# Altium schematic sheet Microcontroller.SchDoc
size A3; SheetNumber: 5; SheetTotal: 9
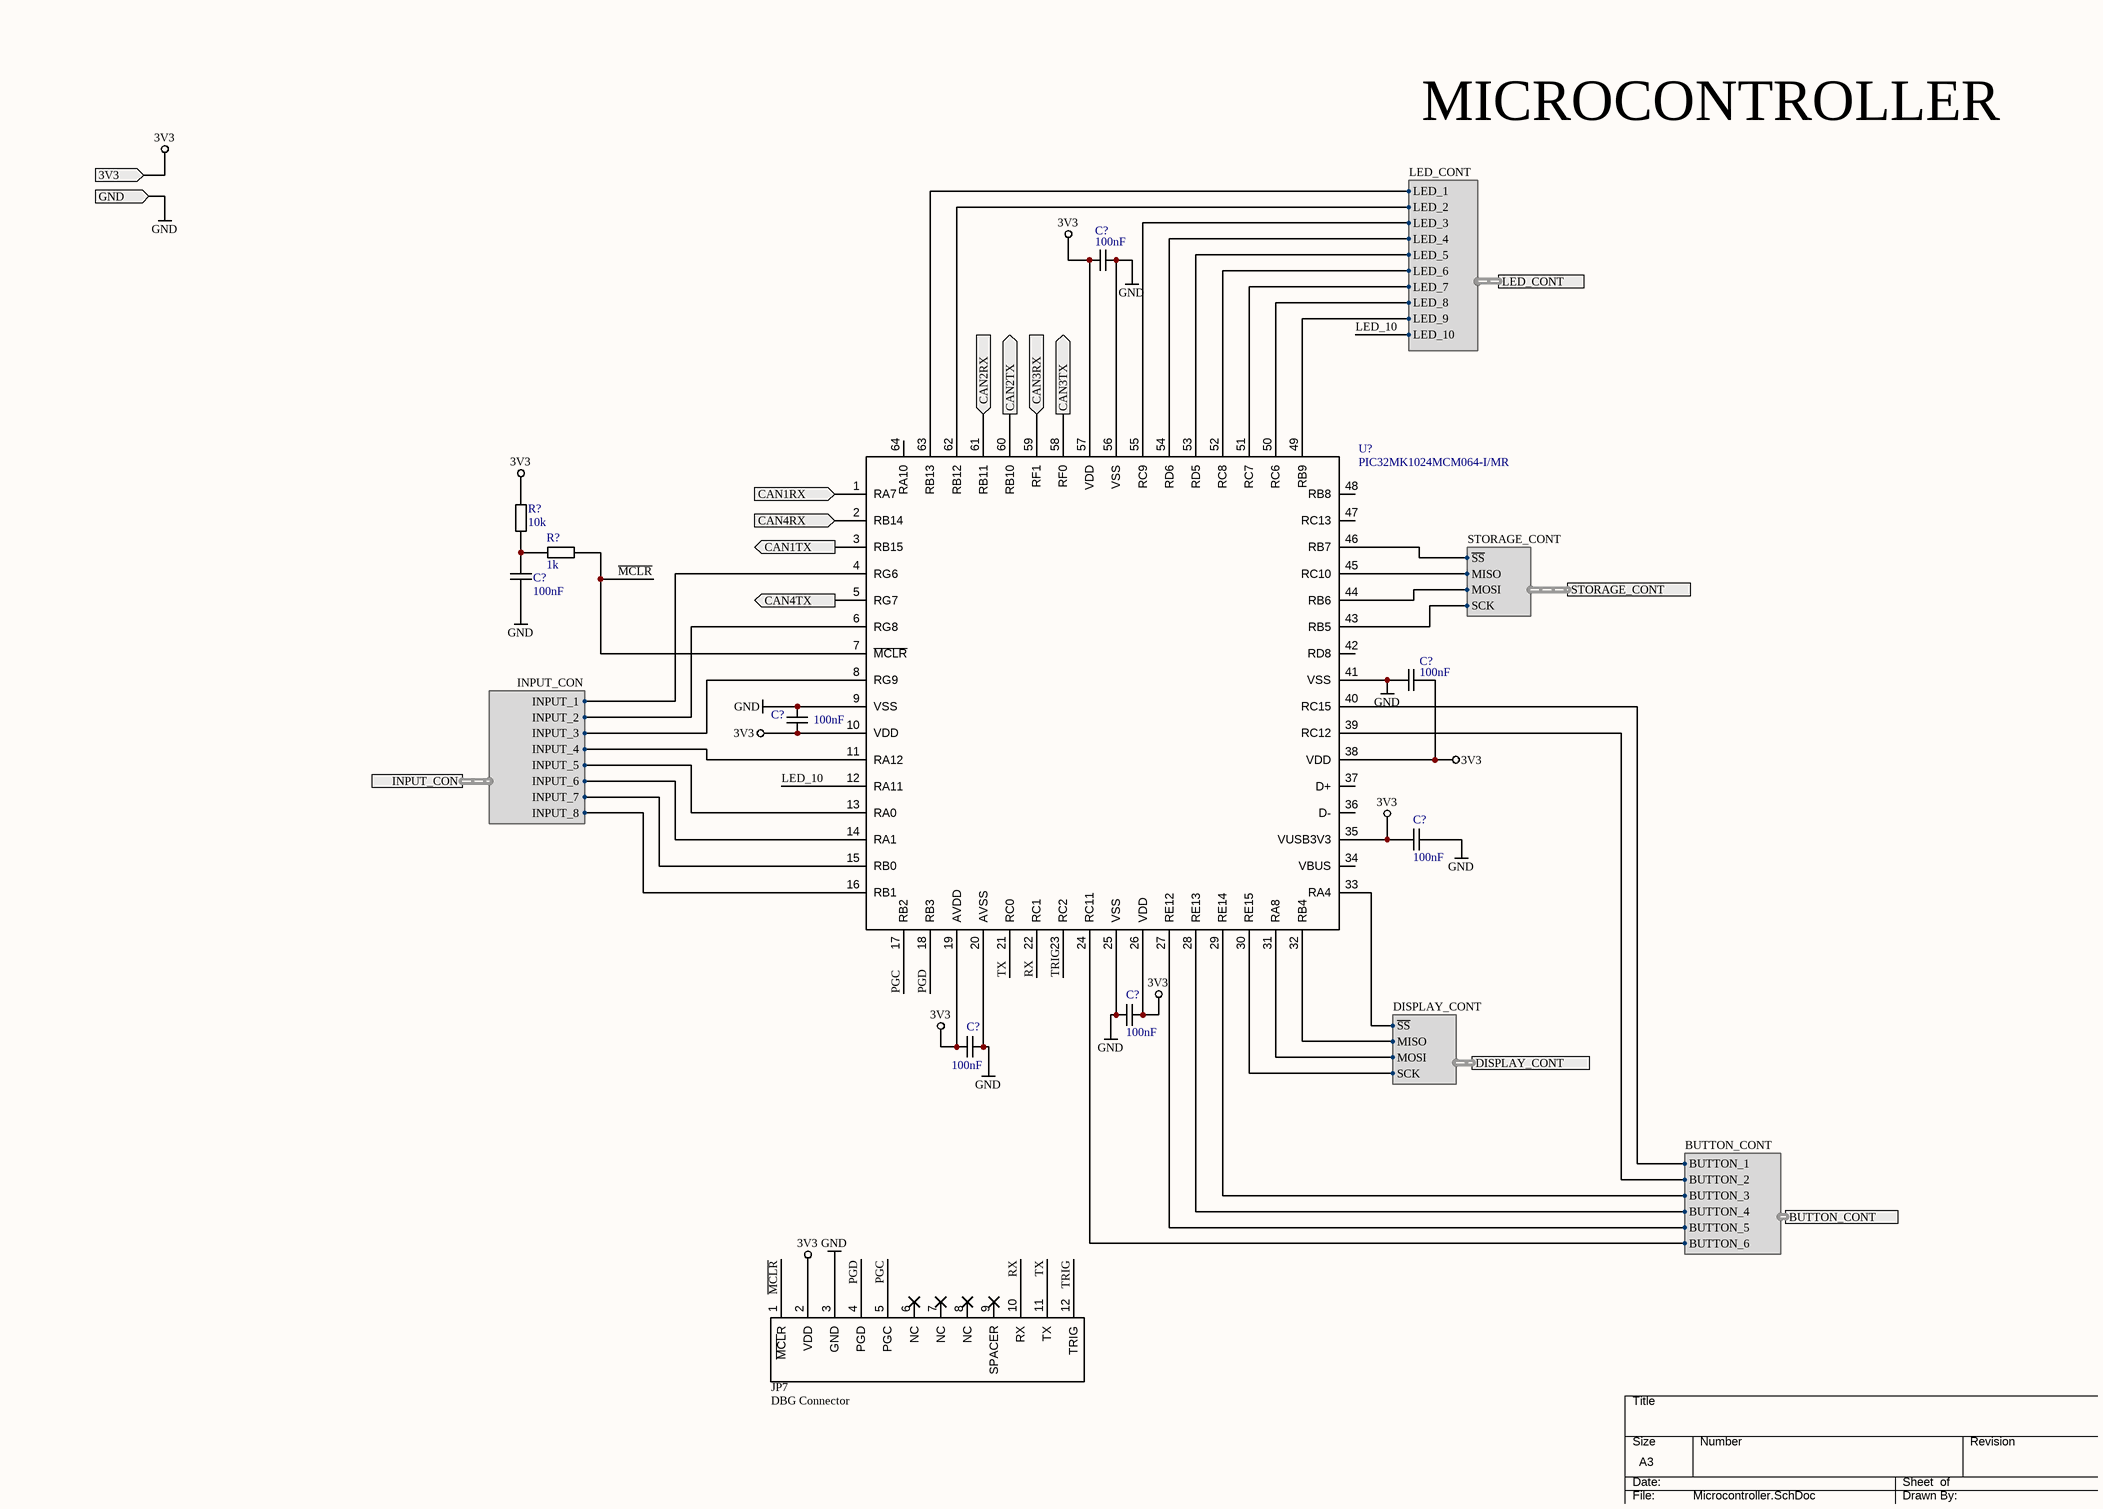
[diagram p0: Microcontroller.SchDoc]

## Parts
(Parts that share a designator on the sheet are numbered #1, #2 ... from top to bottom, then left to right.)
C?#1  100nF  [C_0402]
C?#2  100nF  [C_0402]
C?#3  100nF  [C_0402]
C?#4  100nF  [C_0402]
C?#5  100nF  [C_0402]
C?#6  100nF  [C_0402]
C?#7  100nF  [C_0402]
JP7  DBG Connector  [HDRV12W63P0X254_1X12_3048X254X950P]
R?#1  10k  [R_0402]
R?#2  1k  [R_0402]
U?  PIC32MK1024MCM064-I/MR  [PIC32MK1024MCM064-I/MR]

## Ports
3V3 (in), BUTTON_CONT (harness BUTTON_CONT), CAN1RX (in), CAN1TX (out), CAN2RX (in), CAN2TX (out), CAN3RX (in), CAN3TX (out), CAN4RX (in), CAN4TX (out), DISPLAY_CONT (harness DISPLAY_CONT), GND (in), INPUT_CON (harness INPUT_CON), LED_CONT (harness LED_CONT), STORAGE_CONT (harness STORAGE_CONT)

## Harnesses
INPUT_CON: INPUT_1, INPUT_2, INPUT_3, INPUT_4, INPUT_5, INPUT_6, INPUT_7, INPUT_8
LED_CONT: LED_1, LED_2, LED_3, LED_4, LED_5, LED_6, LED_7, LED_8, LED_9, LED_10
BUTTON_CONT: BUTTON_1, BUTTON_2, BUTTON_3, BUTTON_4, BUTTON_5, BUTTON_6
DISPLAY_CONT: MOSI, MISO, SCK, ~{SS}
STORAGE_CONT: MOSI, MISO, SCK, ~{SS}

## Nets
3V3: C?#1.1 C?#3.1 C?#4.1 C?#5.1 C?#6.1 C?#7.1 JP7.2(VDD) R?#1.2 U?.10(VDD) U?.19(AVDD) U?.26(VDD) U?.35(VUSB3V3) U?.38(VDD) U?.57(VDD) ; port 3V3
GND: C?#1.2 C?#2.1 C?#3.2 C?#4.2 C?#5.2 C?#6.2 C?#7.2 JP7.3(GND) U?.9(VSS) U?.20(AVSS) U?.25(VSS) U?.41(VSS) U?.56(VSS) ; port GND
CAN1RX: U?.1(RA7) ; port CAN1RX
CAN1TX: U?.3(RB15) ; port CAN1TX
CAN2RX: U?.61(RB11) ; port CAN2RX
CAN2TX: U?.60(RB10) ; port CAN2TX
CAN3RX: U?.59(RF1) ; port CAN3RX
CAN3TX: U?.58(RF0) ; port CAN3TX
CAN4RX: U?.2(RB14) ; port CAN4RX
CAN4TX: U?.5(RG7) ; port CAN4TX
LED_10: U?.12(RA11) ; port LED_CONT.LED_10
~{MCLR}: JP7.1(~{MCL}R) R?#2.2 U?.7(~{MCLR})
PGC: JP7.5(PGC) U?.17(RB2)
PGD: JP7.4(PGD) U?.18(RB3)
RX: JP7.10(RX) U?.22(RC1)
TRIG: JP7.12(TRIG) U?.23(RC2)
TX: JP7.11(TX) U?.21(RC0)
NetC?#2_2: C?#2.2 R?#1.1 R?#2.1
NetU?_4: U?.4(RG6) ; port INPUT_CON.INPUT_1
NetU?_6: U?.6(RG8) ; port INPUT_CON.INPUT_2
NetU?_8: U?.8(RG9) ; port INPUT_CON.INPUT_3
NetU?_11: U?.11(RA12) ; port INPUT_CON.INPUT_4
NetU?_13: U?.13(RA0) ; port INPUT_CON.INPUT_5
NetU?_14: U?.14(RA1) ; port INPUT_CON.INPUT_6
NetU?_15: U?.15(RB0) ; port INPUT_CON.INPUT_7
NetU?_16: U?.16(RB1) ; port INPUT_CON.INPUT_8
NetU?_24: U?.24(RC11) ; port BUTTON_CONT.BUTTON_6
NetU?_27: U?.27(RE12) ; port BUTTON_CONT.BUTTON_5
NetU?_28: U?.28(RE13) ; port BUTTON_CONT.BUTTON_4
NetU?_29: U?.29(RE14) ; port BUTTON_CONT.BUTTON_3
NetU?_30: U?.30(RE15) ; port DISPLAY_CONT.SCK
NetU?_31: U?.31(RA8) ; port DISPLAY_CONT.MOSI
NetU?_32: U?.32(RB4) ; port DISPLAY_CONT.MISO
NetU?_33: U?.33(RA4) ; port DISPLAY_CONT.~{SS}
NetU?_39: U?.39(RC12) ; port BUTTON_CONT.BUTTON_2
NetU?_40: U?.40(RC15) ; port BUTTON_CONT.BUTTON_1
NetU?_43: U?.43(RB5) ; port STORAGE_CONT.SCK
NetU?_44: U?.44(RB6) ; port STORAGE_CONT.MOSI
NetU?_45: U?.45(RC10) ; port STORAGE_CONT.MISO
NetU?_46: U?.46(RB7) ; port STORAGE_CONT.~{SS}
NetU?_49: U?.49(RB9) ; port LED_CONT.LED_9
NetU?_50: U?.50(RC6) ; port LED_CONT.LED_8
NetU?_51: U?.51(RC7) ; port LED_CONT.LED_7
NetU?_52: U?.52(RC8) ; port LED_CONT.LED_6
NetU?_53: U?.53(RD5) ; port LED_CONT.LED_5
NetU?_54: U?.54(RD6) ; port LED_CONT.LED_4
NetU?_55: U?.55(RC9) ; port LED_CONT.LED_3
NetU?_62: U?.62(RB12) ; port LED_CONT.LED_2
NetU?_63: U?.63(RB13) ; port LED_CONT.LED_1

Not connected (* = marked no-connect by the designer): JP7 6(NC)* 7(NC)* 8(NC)* 9(SPACER)*; U? 34(VBUS) 36(D-) 37(D+) 42(RD8) 47(RC13) 48(RB8) 64(RA10)

## Notes on the sheet
- MICROCONTROLLER
- THIS DOCUMENT AND THE DATA DISCLOSED HEREIN OR
- HEREWITH IS THE PROPERTY OF ALTIUM LIMITED AND MAY
- DWG NO:
- REVISION
- REV:
- DESCRIPTION
- DATE
- APPROVED
- BE FREELY DISTRIBUTED IN WHOLE. NO RIGHTS ARE
- RESERVED OR EXPRESS OR IMPLIED WARANTEE GIVEN.
- ENG:
- APPROVALS
- PROJECT
- DSN:
- CHK:
- REFERENCE DOCUMENTS
- PROJECT REVISION:
- TITLE
- DOCUMENT REVISION:
- DESIGN ITEM:
- BOM:
- FAB DWG:
- PCB DWG:
- ASSY DWG:
- SCALE:
- A3
- SIZE
- CAGE CODE
- FILE NAME
- DWG NO.
- SHEET
- OF
- REV

## Library data of the parts
C?#1 C?#3-C?#7 = C0402C104J8RACAUTO: 100nF 10V 0402 X7R
C?#2 = CGA2B3X7R1H104K050BE: 100nF 50V X7R
JP7 = PICKitConnector: 2.54mm Header for Pickit 4
R?#1 = SFR01MZPF1002: 10k 1% 62.5mW
R?#2 = ESR01MZPJ102: 1k 5% 200mW
U? = PIC32MK1024MCM064-I/MR: RC13 and RB8 only Inputs (when used are slower)